# EAGLE design LocoShield-TMH (EAGLE 7.7.0)
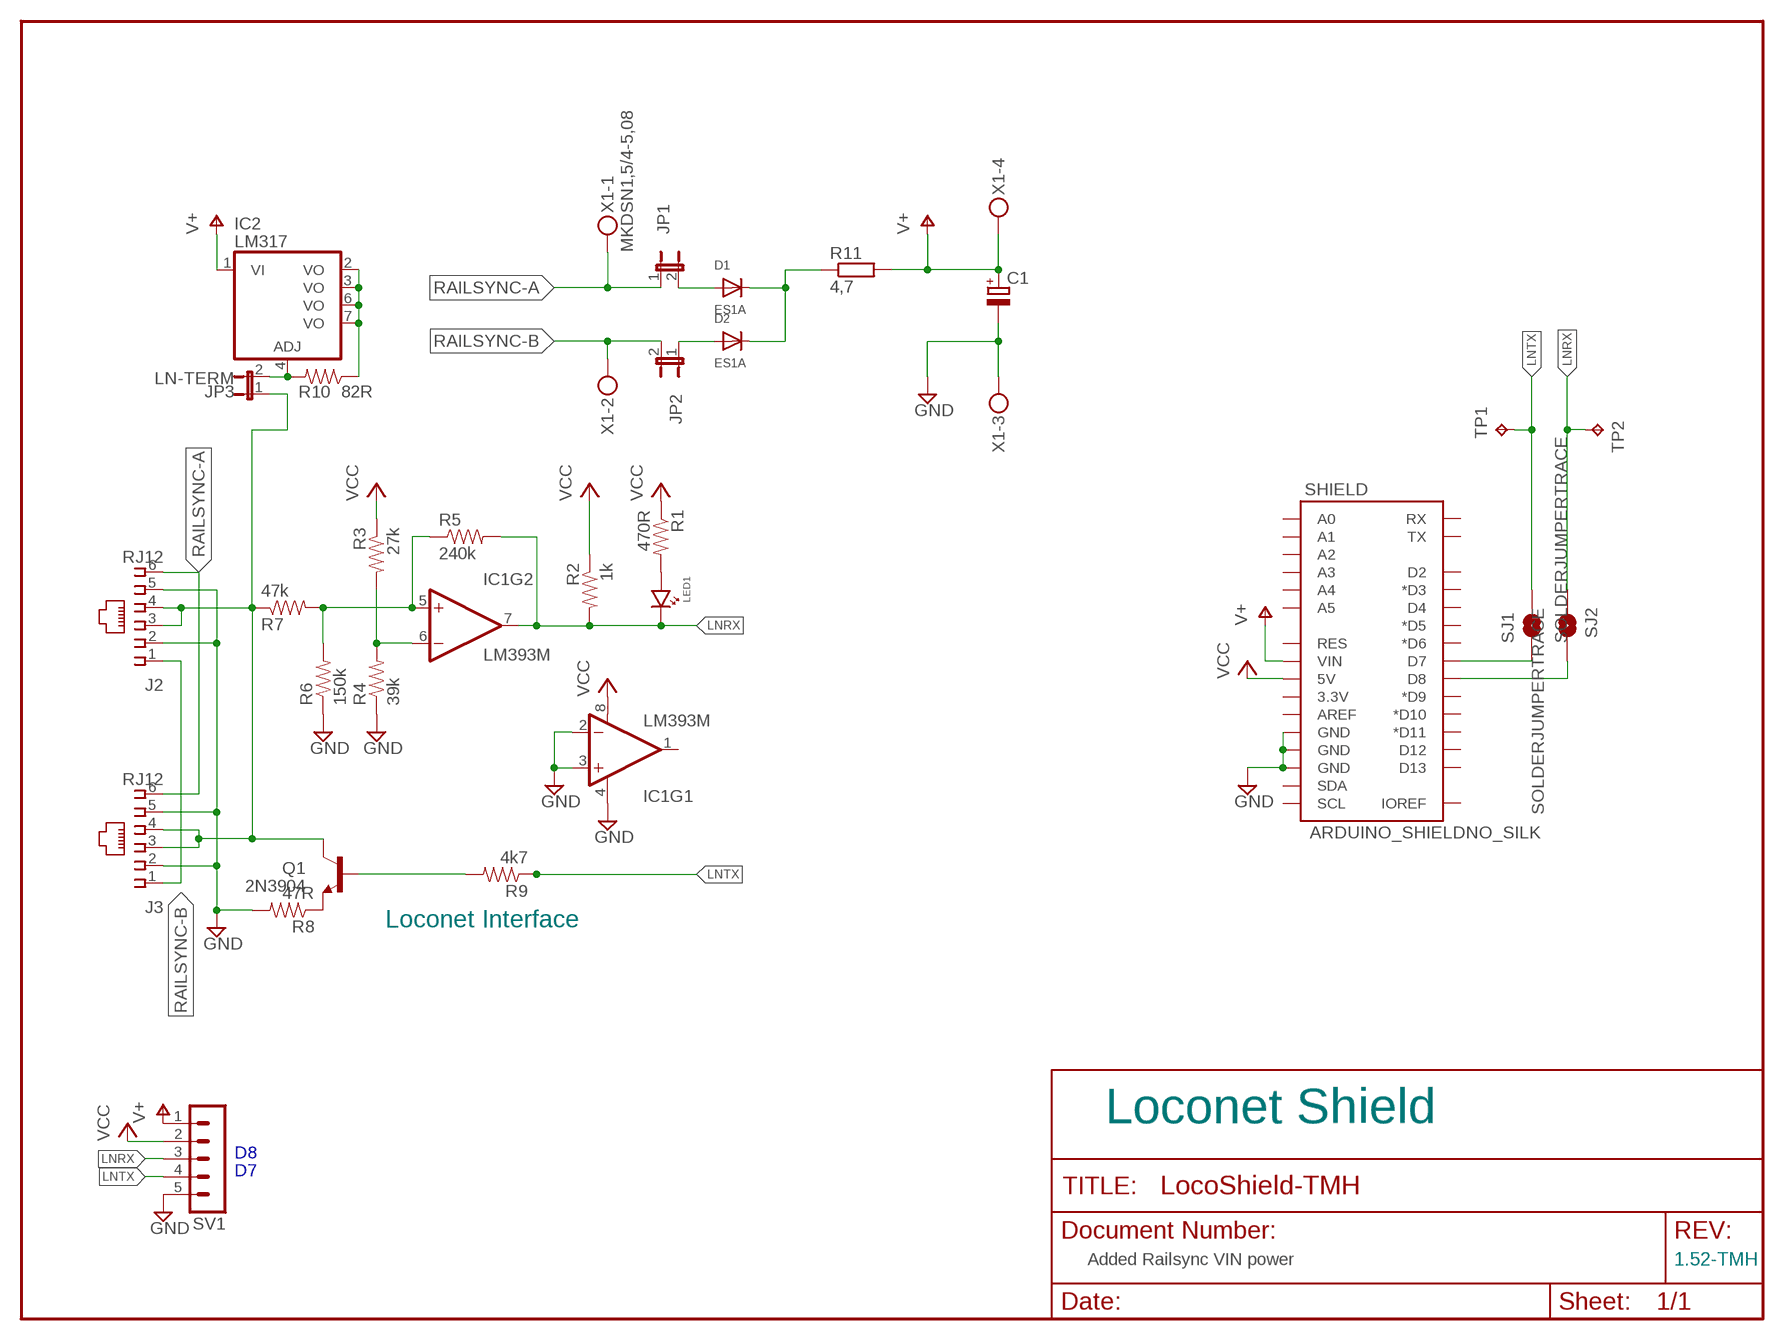
[diagram p0: schematic, sheet 1]

## Parts
C1  CPOL-EUE2-5  [E2-5]
D1  ES1A  DIODESMA  [SMADIODE]
D2  ES1A  DIODESMA  [SMADIODE]
IC1  LM393M  [SO08@1]
IC2  LM317  LM317LD  [SO08]
J2  RJ12  520250-3  [520250-3]
J3  RJ12  520250-3  [520250-3]
JP1  JUMPER-2PTH_LOCK  [1X02_LOCK]
JP2  JUMPER-2PTH_LOCK  [1X02_LOCK]
JP3  LN-TERM  JUMPER-2PTH_LOCK  [1X02_LOCK]
LED1  LED0805-LED  [0805-LED]
Q1  2N3904  NPN-SOT23-3  [SOT23-3]
R1  470R  R0805-RES  [0805-RES]
R2  1k  R0805-RES  [0805-RES]
R3  27k  R0805-RES  [0805-RES]
R4  39k  R0805-RES  [0805-RES]
R5  240k  R0805-RES  [0805-RES]
R6  150k  R0805-RES  [0805-RES]
R7  47k  R0805-RES  [0805-RES]
R8  47R  R0805-RES  [0805-RES]
R9  4k7  R0805-RES  [0805-RES]
R10  82R  R0805-RES  [0805-RES]
R11  4,7  R-EU_R1206  [R1206]
SHIELD  ARDUINO_SHIELDNO_SILK  [DUEMILANOVE_VIAS]
SJ1  SOLDERJUMPERTRACE  [SJ_2S-TRACE]
SJ2  SOLDERJUMPERTRACE  [SJ_2S-TRACE]
SV1  MA05-1  [MA05-1]
TP1  TPPAD1-17  [P1-17]
TP2  TPPAD1-17  [P1-17]
X1  MKDSN1,5/4-5,08  [MKDSN1,5/4-5,08]

## Nets
GND [Power]: C1.- IC1.2(-IN) IC1.3(+IN) IC1.4(V-) J2.2 J2.5 J3.2 J3.5 R4.1 R6.1 R8.2 SHIELD.GND@0(GND) SHIELD.GND@1(GND) SHIELD.GND@2(GND) SV1.5 X1.3
LNRX: IC1.7(OUT) LED1.C R2.2 R5.2 SJ2.1 SV1.3 TP2.TP
LNTX: R9.1 SJ1.2 SV1.4 TP1.TP
LOCONET [Power]: J2.3 J2.4 J3.3 J3.4 JP3.1 Q1.3(C) R7.1
N$1: Q1.1(B) R9.2
N$2: IC1.5(+IN) R5.1 R6.2 R7.2
N$3: D1.A JP1.2
N$4: D2.A JP2.1
N$5: IC1.6(-IN) R3.2 R4.2
N$6: Q1.2(E) R8.1
N$7: SHIELD.D8 SJ2.2
N$8: SHIELD.D7 SJ1.1
N$9 [Power]: D1.C D2.C R11.1
N$15: LED1.A R1.2
N$20 [Power]: IC2.4(ADJ) JP3.2 R10.2
RAILSYNC-A: J2.6 J3.6 JP1.1 X1.1
RAILSYNC-B: J2.1 J3.1 JP2.2 X1.2
V+ [Power]: C1.+ IC2.1(VI) R11.2 SHIELD.VIN SV1.1 X1.4
VCC [Power]: IC1.8(V+) R1.1 R2.1 R3.1 SHIELD.5V SV1.2
VOUT [Power]: IC2.2(VO) IC2.3(VO) IC2.6(VO) IC2.7(VO) R10.1
Unconnected: IC1.1(OUT) SHIELD.3.3V SHIELD.A0 SHIELD.A1 SHIELD.A2 SHIELD.A3 SHIELD.A4 SHIELD.A5 SHIELD.AREF SHIELD.D2 SHIELD.D3(*D3) SHIELD.D4 SHIELD.D5(*D5) SHIELD.D6(*D6) SHIELD.D9(*D9) SHIELD.D10(*D10) SHIELD.D11(*D11) SHIELD.D12 SHIELD.D13 SHIELD.IOREF SHIELD.RES SHIELD.RX SHIELD.SCL SHIELD.SDA SHIELD.TX

## Notes on the sheet
- Loconet Interface
- Loconet Shield
- D8
- D7
- Added Railsync VIN power | 1.52-TMH

## Library data of the parts
C1 = rcl:CPOL-EU: POLARIZED CAPACITOR, European symbol
D1 D2 = adafruit:DIODE: Diode SMADIODE - SMA Surface Mount Package 20V 1A Schottky Diode Digikey: 641-1014-6-ND DO-1N4148 - Through Hole Small Current Diode SOD-123 20V 1 A (.5mV Vf) Schottky Diode - Digikey: MBRX120TPMSCT-ND SOD-323 10V 570mA (.38mV Vf, 3ns) Schottky Diode - Digikey: ZLLS410CT-ND SOD-523 30V 30mA Schottky Diode (RB751S-40TE61) - Digikey: RB751S-40TE61CT-ND SOT23-R/W - SOT23 Package (R = Solder Paste/Reflow Ovens, W = Hand-Soldering) BAT54Film 40V 300mA - Digikey: 497-7162-1-ND; ELFA: 170-00-843
IC1 = MCP:LM393; ELFA: 73-291-96
IC2 = MCP:LM317LD: LOW CURRENT 1.2 TO 37V ADJUSTABLE VOLTAGE REGULATOR Source: http://pdf.alldatasheet.com; ELFA: 73-131-69
J2 J3 = con-amp:520250-3: AMP connector; ELFA: 42-688-27
JP1 JP2 = SPCoast:JUMPER-2: Jumper Basic 0.1" spaced jumper. Use with breakaway headers.; ELFA: 124-50-887
JP3 = MCP:JUMPER-2: Jumper Basic 0.1" spaced jumper. Use with breakaway headers.; ELFA: 124-50-887
LED1 = SPCoast:LED*; ELFA: 75-308-68
Q1 = MCP:NPN: Transistor NPN BJT configuration in SOT23 package. MMBT2222 is the common NPN we use. Double check BCE configuration again layout.; ELFA: 300-50-414
R1 = SPCoast:R*: Resistor Basic schematic elements and footprints for 0603, 1206, and PTH 1/10th watt (small) resistors.; ELFA: 60-255-17
R2 = SPCoast:R*: Resistor Basic schematic elements and footprints for 0603, 1206, and PTH 1/10th watt (small) resistors.; ELFA: 60-255-21
R3 = SPCoast:R*: Resistor Basic schematic elements and footprints for 0603, 1206, and PTH 1/10th watt (small) resistors.; ELFA: 60-255-48
R4 = SPCoast:R*: Resistor Basic schematic elements and footprints for 0603, 1206, and PTH 1/10th watt (small) resistors.; ELFA: 60-255-50
R5 = SPCoast:R*: Resistor Basic schematic elements and footprints for 0603, 1206, and PTH 1/10th watt (small) resistors.; ELFA: 60-180-63
R6 = SPCoast:R*: Resistor Basic schematic elements and footprints for 0603, 1206, and PTH 1/10th watt (small) resistors.; ELFA: 60-255-57
R7 = SPCoast:R*: Resistor Basic schematic elements and footprints for 0603, 1206, and PTH 1/10th watt (small) resistors.; ELFA: 60-255-51
R8 = SPCoast:R*: Resistor Basic schematic elements and footprints for 0603, 1206, and PTH 1/10th watt (small) resistors.; ELFA: 60-255-04
R9 = SPCoast:R*: Resistor Basic schematic elements and footprints for 0603, 1206, and PTH 1/10th watt (small) resistors.; ELFA: 60-255-39
R10 = SPCoast:R*: Resistor Basic schematic elements and footprints for 0603, 1206, and PTH 1/10th watt (small) resistors.; ELFA: 60-255-07
R11 = rcl:R-EU_: RESISTOR, European symbol; ELFA: 160-98-710
SHIELD = SPCoast:ARDUINO_SHIELD
SJ1 SJ2 = SparkFun-Retired:SOLDERJUMPER: Solder Jumper Standard SMD solder jumper. Used to automate production. Two varients : Normally Open and Normally Closed are the same, but have different paste layers. NC will have a large amount of paste and should jumper during reflow.
SV1 = con-lstb:MA05-1: PIN HEADER; ELFA: 143-00-499; OC_FARNELL: unknown; OC_NEWARK: unknown
TP1 TP2 = testpad:TP: Test pad
X1 = con-phoenix-508:MKDSN1,5/4-5,08: MKDSN 1,5/ 4-5,08 Printklemme Nennstrom: 13,5 A Nennspannung: 250 V Rastermaß: 5,08 mm Polzahl: 4 Anschlussart: Schraubanschluss Montage: Löten Anschlussrichtung Leiter/Platine: 0 ° Artikelnummer: 1729144 Source: http://eshop.phoenixcontact.com .. 1729144.pdf; MPN: SMKDSN1,5/4-5,08; OC_FARNELL: 1792905; OC_NEWARK: 70R0300

## Net classes
0 default: width 0.254 mm
1 Power: width 0.406 mm, clearance 0.254 mm

## Board
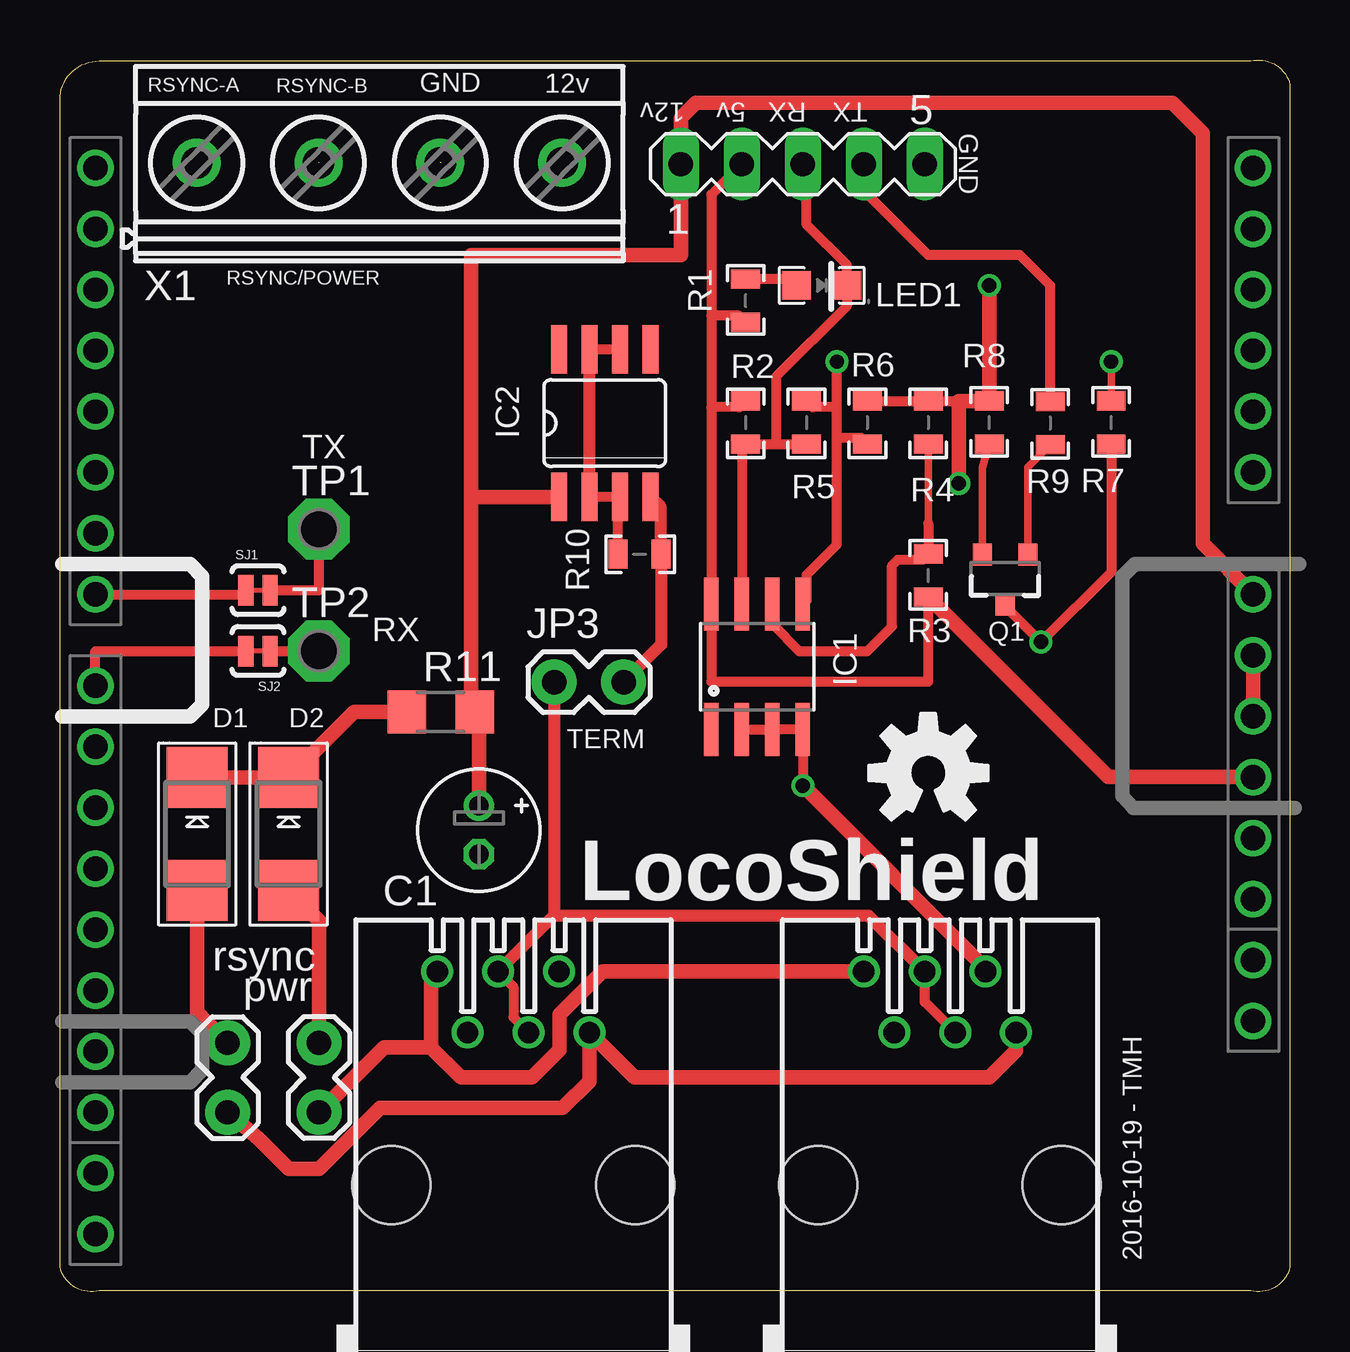
[diagram p1: board, top side]
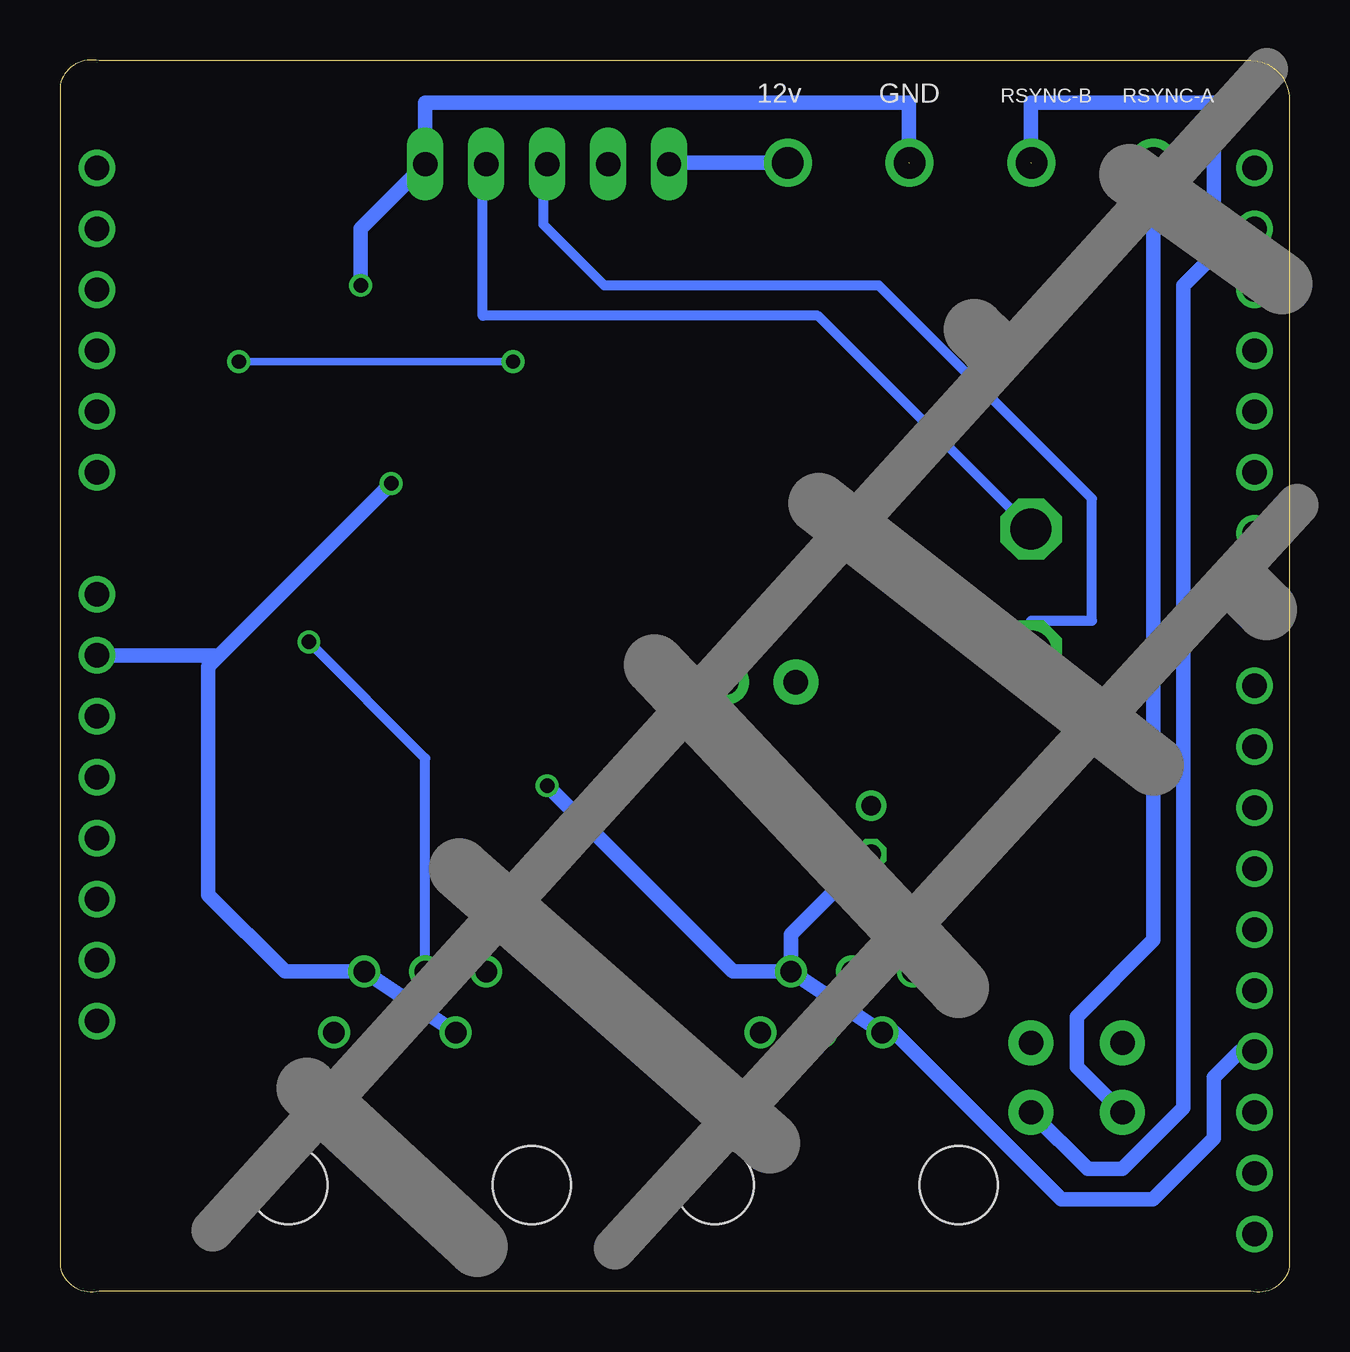
[diagram p2: board, bottom side, seen from below]

Size 51.27 x 51.34 mm. Coordinates in mm from the lower left corner, seen from the top.
Outline: 49.63,0.04 1.64,0.04 arc-90 0,1.04 0,49.67 arc-90 1.64,51.31 49.63,51.31 arc-90 51.27,50.31 51.27,1.04 arc-90 49.63,0.04
Copper layers (1*16): Top 0.0356mm / dielectric 1.5011mm / Bottom 0.0356mm
Design rules "oshpark-2layer": minimum track width 6mil, minimum drill 13mil, track to track 6mil, track to pad 6mil, pad to pad 6mil, via to via 6mil, smd to smd 6mil, copper to edge 15mil, drill to drill 6mil, minimum pad ring 7mil, minimum via ring 7mil, stop-mask expansion 4mil, vias tented up to drill 0mil, thermal gap 10mil

### Footprints (pad centres in the part's own frame; a part is rotated, then mirrored left to right if it is on the bottom)
E2-5 = drill 0.813 pad 1.27: + -1.016,0 | drill 0.813 pad 1.27 octagon: - 1.016,0
SMADIODE = smd 2.54 x 2.54: A 2.349,0; C -2.349,0
SO08@1 = smd 0.61 x 2.21: 1 -1.905,-2.616; 2 -0.635,-2.616; 3 0.635,-2.616; 4 1.905,-2.616; 5 1.905,2.616; 6 0.635,2.616; 7 -0.635,2.616; 8 -1.905,2.616
SO08 = smd 0.66 x 2.032: 1 -1.905,-3.073; 2 -0.635,-3.073; 3 0.635,-3.073; 4 1.905,-3.073; 5 1.905,3.073; 6 0.635,3.073; 7 -0.635,3.073; 8 -1.905,3.073
520250-3 = drill 0.889: 1 -3.175,8.89; 2 -1.905,6.35; 3 -0.635,8.89; 4 0.635,6.35; 5 1.905,8.89; 6 3.175,6.35 | hole 3.251: -5.08,0; 5.08,0
1X02_LOCK = drill 1.016 pad 1.88: 1 -0.178,0; 2 2.718,0
0805-LED = smd 1.2 x 1.2: A -1.05,0; C 1.05,0
SOT23-3 = smd 0.8 x 0.9: 1 -0.95,-1; 2 0.95,-1; 3 0,1.1
0805-RES = smd 0.8 x 1.2: 1 -0.9,0; 2 0.9,0
R1206 = smd 1.6 x 1.803: 1 -1.422,0; 2 1.422,0
DUEMILANOVE_VIAS = drill 1.016: 3.3V 49.53,17.78; 5V 49.53,20.32; A0 49.53,33.02; A1 49.53,35.56; A2 49.53,38.1; A3 49.53,40.64; A4 49.53,43.18; A5 49.53,45.72; AREF 1.27,6.35; D2 1.27,40.64; D3 1.27,38.1; D4 1.27,35.56; D5 1.27,33.02; D6 1.27,30.48; D7 1.27,27.94; D8 1.27,24.13; D9 1.27,21.59; D10 1.27,19.05; D11 1.27,16.51; D12 1.27,13.97; D13 1.27,11.43; GND@0 49.53,22.86; GND@1 49.53,25.4; GND@2 1.27,8.89; IOREF 49.53,12.7; NC1 49.53,10.16; RES 49.53,15.24; RX 1.27,45.72; SCL 1.27,1.27; SDA 1.27,3.81; TX 1.27,43.18; VIN 49.53,27.94
SJ_2S-TRACE = smd 0.635 x 1.27: 1 -0.508,0; 2 0.508,0
MA05-1 = drill 1.016 long: 1 -5.08,0; 2 -2.54,0; 3 0,0; 4 2.54,0; 5 5.08,0
P1-17 = drill 1.702 pad 2.54 octagon: TP 0,0
MKDSN1,5/4-5,08 = drill 1.3 pad 2: 1 -7.641,0.025; 2 -2.561,0.025; 3 2.519,0.025; 4 7.599,0.025

### Placement (x,y rotation side)
C1  17.46,19.25 270 top
D1  5.71,19.09 270 top
D2  9.53,19.09 270 top
IC1  29.06,26.05 0 top
IC2  22.71,36.21 0 top
J2  36.68,4.46 0 top
J3  18.9,4.46 0 top
JP1  6.98,7.66 90 top
JP2  10.79,10.2 270 top
JP3  20.78,25.41 0 top
LED1  31.75,41.95 0 top
Q1  39.4,29.73 180 top
R1  28.58,41.31 90 top
R2  28.58,36.23 270 top
R3  36.2,29.86 90 top
R4  36.2,36.23 270 top
R5  31.12,36.23 270 top
R6  33.66,36.23 270 top
R7  43.81,36.23 90 top
R8  38.73,36.23 90 top
R9  41.27,36.21 270 top
R10  24.16,30.75 0 top
R11  15.88,24.17 0 top
SHIELD  0.2,1.13 0 top
SJ1  8.26,29.25 0 top
SJ2  8.26,26.71 180 top
SV1  30.96,47 0 top
TP1  10.79,31.79 0 top
TP2  10.79,26.71 0 top
U$1  OSHW-LOGOM  [OSHW-LOGO-M]  36.2,21.63 0 top
X1  13.33,47.03 0 top

### Tracks (layer width: path | path; a pad name or v marks a point on that pad's centre or on a via)
GND  (via drill 0.6)  (1 unrouted)
  Top 0.406: IC1.2 IC1.3 IC1.4 v30.96,21.09 | R6.1 R4.1 37.46,37.13
  Top 0.61: v37.46,33.69 37.46,37.13 R8.2 v38.73,41.95 | J2.5 38.58,13.47 v30.96,21.09 | SHIELD.GND@0 SHIELD.GND@1
  Bottom 0.61: J3.5 23.22,13.35 v30.96,21.09 | J2.2 J2.5 41.88,13.35 45.09,16.55 45.09,26.07 v37.46,33.69 44.63,26.53 SHIELD.GND@1 | J3.5 20.8,14.89 C1.- | v38.73,41.95 38.73,44.31 SV1.5 36.04,49.57 15.88,49.57 15.88,47.05 | J3.5 J3.2 16.48,10.81 9.53,3.85 5.71,3.85 3.17,6.39 3.17,8.93 2.08,10.02 SHIELD.GND@2
LNRX
  Top 0.305: IC1.7 28.42,28.59
  Top 0.406: 29.85,35.33 R2.2 28.42,35.33 IC1.7 | 29.85,35.33 R5.2 | 29.85,35.33 29.85,38.14 32.8,41.09 LED1.C 32.8,42.8 31.12,44.49 31.12,46.85 SV1.3 | SJ2.1 TP2.TP
  Bottom 0.406: TP2.TP 10.79,27.98 8.26,27.98 8.26,33.06 17.15,41.95 28.58,41.95 31.12,44.49 31.12,46.85 SV1.3
LNTX
  Top 0.406: SJ1.2 10.79,29.25 TP1.TP | R9.1 41.27,41.95 40,43.22 36.2,43.22 33.66,45.76 33.66,46.85 SV1.4
  Bottom 0.406: TP1.TP 19.69,40.68 33.66,40.68 33.66,47 SV1.4
LOCONET  (via drill 0.6)
  Top 0.406: J3.4 18.9,11.44 18.9,12.71 J3.3 | J2.4 36.04,12.08 J2.3 | R7.1 43.81,30.01 v40.89,27.09 39.39,28.59 Q1.3
  Top 0.508: JP3.1 20.6,15.68 | 20.6,15.68 J3.3 | 20.6,15.68 33.71,15.68 J2.3
  Bottom 0.406: J2.3 36.04,22.24 v40.89,27.09
N$1
  Top 0.305: R9.2 40.34,34.38 Q1.1
N$2  (via drill 0.6)
  Top 0.305: R7.2 v43.81,38.77
  Top 0.406: 32.38,35.6 32.38,31.15 31.12,29.88 31.12,28.81 IC1.5 | 32.38,35.6 32.38,36.87 | 32.38,36.87 v32.38,38.77 | 32.38,35.6 33.39,35.6 R6.2 | 32.38,36.87 31.38,36.87 R5.1
  Bottom 0.305: v32.38,38.77 v43.81,38.77
N$3
  Top 0.61: JP1.2 5.71,11.64 D1.A
N$4
  Top 0.61: JP2.1 10.79,15.47 D2.A
N$5
  Top 0.305: IC1.6 29.69,27.82 | R4.2 36.2,32.03
  Top 0.406: 29.69,27.82 30.81,26.71 33.66,26.71 34.68,27.74 34.68,30.28 34.92,30.52 35.95,30.52 R3.2 36.2,32.03
N$6
  Top 0.305: R8.1 38.45,34.35 Q1.2
N$7
  Top 0.406: SHIELD.D8 1.47,26.71 SJ2.2
N$8
  Top 0.406: SHIELD.D7 7.75,29.07 SJ1.1
N$9
  Top 0.61: D1.C D2.C 12.25,24.17 R11.1
N$15
  Top 0.406: LED1.A arc90 30.44,42.21 R1.2
N$20
  Top 0.508: IC2.4 25.04,32.7 R10.2 25.06,26.97 JP3.2
RAILSYNC-A
  Top 0.61: J2.6 39.85,10.04 38.73,8.93 23.95,8.93 J3.6 22.07,8.77 20.96,7.66 13.33,7.66 10.79,5.12 9.53,5.12 8.26,6.39 JP1.1
  Bottom 0.61: JP1.1 8.89,9.38 8.89,11.47 5.69,14.66 X1.1
RAILSYNC-B  (1 unrouted)
  Top 0.508: 15.44,10.2 15.47,10.17 | 15.47,13.09 J3.1
  Top 0.61: 15.47,13.09 15.47,10.17 16.71,8.93 19.69,8.93 20.83,10.07 20.83,11.56 22.62,13.35 J2.1 | JP2.2 13.51,10.2 15.44,10.2
  Bottom 0.61: 10.79,47.05 10.79,49.57 3.17,49.57 3.17,43.22 4.45,41.95 4.45,7.66 6.98,5.12 8.43,5.12 JP2.2
V+
  Top 0.61: C1.+ 17.46,24.17 R11.2 17.15,24.17 17.15,33.13 | 17.15,33.13 17.15,43.22 25.88,43.22 SV1.1 25.88,48.93 26.52,49.57 46.35,49.57 47.62,48.3 47.62,31.18 SHIELD.VIN | IC2.1 17.15,33.13
  Bottom 0.61: X1.4 25.88,47.05 SV1.1
VCC
  Top 0.406: SV1.2 27.15,45.73 27.15,40.68 | 27.15,40.68 27.15,36.87 | 27.15,36.87 IC1.8 27.15,25.44 36.2,25.44 R3.1 | R1.1 28.31,40.68 27.15,40.68 | R2.1 28.31,36.87 27.15,36.87
  Top 0.61: SHIELD.5V 43.7,21.45 R3.1
VOUT
  Top 0.406: IC2.6 IC2.7 | IC2.2 IC2.3 23.26,33.05 R10.1
  Top 0.508: IC2.2 IC2.7

### Text on the board
tPlace: RSYNC-A | RSYNC-B | GND | 12v | 12v | 5v | RX | TX | GND | RSYNC/POWER | TX | RX | TERM | LocoShield | rsync | pwr | 2016-10-19 - TMH
bPlace: RSYNC-A | RSYNC-B | GND | 12v
tDocu: John Plocher | OSHW | Activity | * | UNO | * | Component / Side | To Lnet
bDocu: Made in the PCR, Coast Division, NMRA | LocoShield | Solder Side | Go Bears! | SP Coast | www. | .com | RX pin goes to Timer ICP pin / Uno -> pin 8 / Leonardo -> pin 4 / Mega -> pin 48 (Timer 5) or 49 (T4) | Model Railroading is fun!